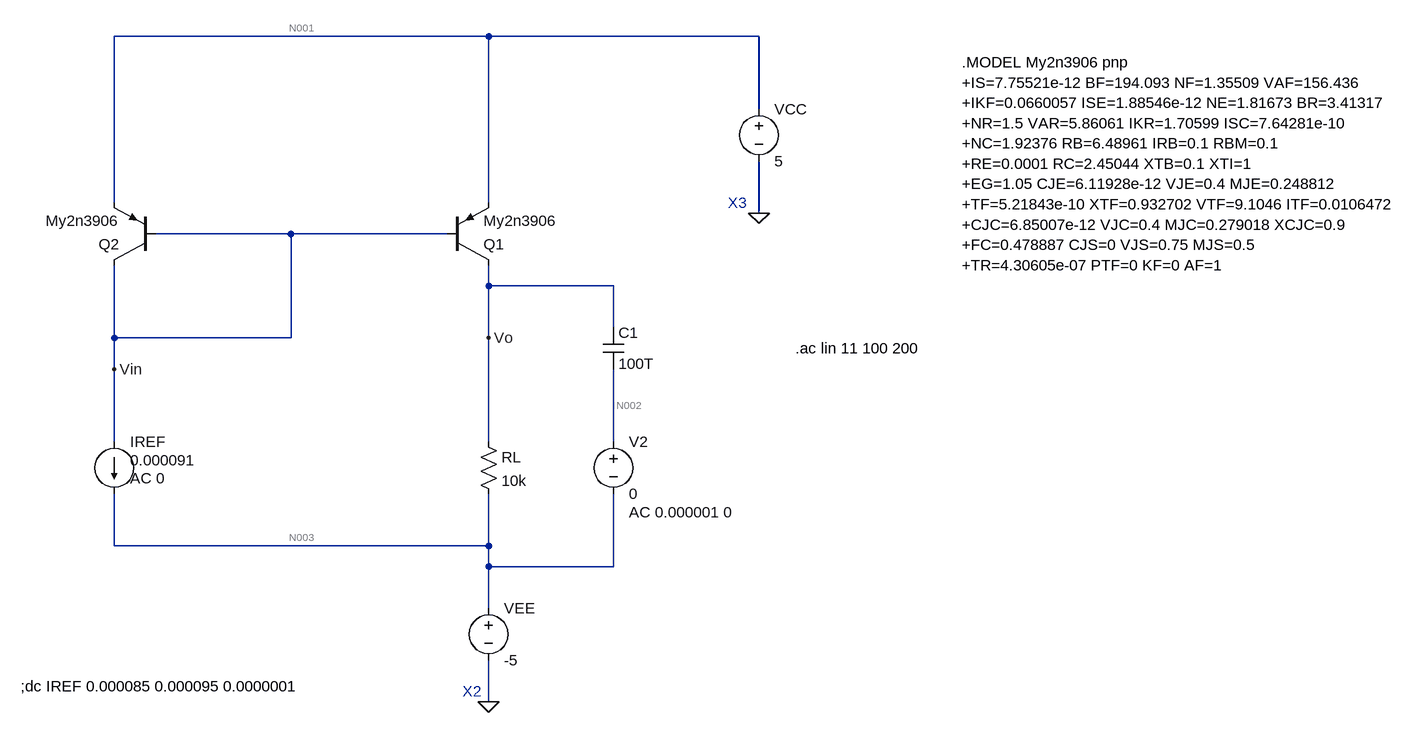
[diagram p0: schematic B.asc]
B.asc, the LTspice schematic file:
Version 4
SHEET 1 1424 680
WIRE -32 -576 -608 -576
WIRE 384 -576 -32 -576
WIRE 384 -464 384 -576
WIRE -608 -320 -608 -576
WIRE -32 -320 -32 -576
WIRE 384 -304 384 -384
WIRE -336 -272 -544 -272
WIRE -96 -272 -336 -272
WIRE -32 -192 -32 -224
WIRE 160 -192 -32 -192
WIRE 160 -128 160 -192
WIRE -608 -112 -608 -224
WIRE -336 -112 -336 -272
WIRE -336 -112 -608 -112
WIRE -32 -112 -32 -192
WIRE -608 -64 -608 -112
WIRE -608 48 -608 -64
WIRE -32 48 -32 -112
WIRE 160 48 160 -64
WIRE -608 208 -608 128
WIRE -32 208 -32 128
WIRE -32 208 -608 208
WIRE -32 240 -32 208
WIRE 160 240 160 128
WIRE 160 240 -32 240
WIRE -32 304 -32 240
WIRE -32 448 -32 384
FLAG -32 448 0
FLAG 384 -304 0
FLAG -32 -112 Vo
FLAG -608 -64 Vin
SYMBOL voltage -32 288 R0
WINDOW 123 0 0 Left 0
WINDOW 39 0 0 Left 0
SYMATTR InstName VEE
SYMATTR Value -5
SYMBOL res -48 32 R0
SYMATTR InstName RL
SYMATTR Value 10k
SYMBOL pnp -96 -224 M180
SYMATTR InstName Q1
SYMATTR Value My2n3906
SYMBOL pnp -544 -224 R180
SYMATTR InstName Q2
SYMATTR Value My2n3906
SYMBOL voltage 384 -480 R0
WINDOW 123 0 0 Left 0
WINDOW 39 0 0 Left 0
SYMATTR InstName VCC
SYMATTR Value 5
SYMBOL current -608 48 R0
WINDOW 3 24 28 Left 2
WINDOW 123 24 56 Left 2
WINDOW 39 0 0 Left 0
SYMATTR InstName IREF
SYMATTR Value 0.000091
SYMATTR Value2 AC 0
SYMBOL cap 144 -128 R0
SYMATTR InstName C1
SYMATTR Value 100T
SYMBOL voltage 160 32 R0
WINDOW 123 24 124 Left 2
WINDOW 39 0 0 Left 0
SYMATTR InstName V2
SYMATTR Value 0
SYMATTR Value2 AC 0.000001 0
TEXT 336 -320 Left 2 ;X3
TEXT 696 -536 Left 2 !.MODEL My2n3906 pnp\n+IS=7.75521e-12 BF=194.093 NF=1.35509 VAF=156.436\n+IKF=0.0660057 ISE=1.88546e-12 NE=1.81673 BR=3.41317\n+NR=1.5 VAR=5.86061 IKR=1.70599 ISC=7.64281e-10\n+NC=1.92376 RB=6.48961 IRB=0.1 RBM=0.1\n+RE=0.0001 RC=2.45044 XTB=0.1 XTI=1\n+EG=1.05 CJE=6.11928e-12 VJE=0.4 MJE=0.248812\n+TF=5.21843e-10 XTF=0.932702 VTF=9.1046 ITF=0.0106472\n+CJC=6.85007e-12 VJC=0.4 MJC=0.279018 XCJC=0.9\n+FC=0.478887 CJS=0 VJS=0.75 MJS=0.5\n+TR=4.30605e-07 PTF=0 KF=0 AF=1
TEXT -72 432 Left 2 ;X2
TEXT -752 424 Left 2 !;dc IREF 0.000085 0.000095 0.0000001
TEXT 440 -96 Left 2 !.ac lin 11 100 200

The netlist it stands for:
* B.asc
VEE N003 0 -5
RL Vo N003 10k
Q1 Vo Vin N001 0 My2n3906
Q2 Vin Vin N001 0 My2n3906
VCC N001 0 5
IREF Vin N003 0.000091 AC 0
C1 Vo N002 100T
V2 N002 N003 0 AC 0.000001 0
.model NPN NPN
.model PNP PNP
.lib standard.bjt
* X3
.MODEL My2n3906 pnp
+IS=7.75521e-12 BF=194.093 NF=1.35509 VAF=156.436
+IKF=0.0660057 ISE=1.88546e-12 NE=1.81673 BR=3.41317
+NR=1.5 VAR=5.86061 IKR=1.70599 ISC=7.64281e-10
+NC=1.92376 RB=6.48961 IRB=0.1 RBM=0.1
+RE=0.0001 RC=2.45044 XTB=0.1 XTI=1
+EG=1.05 CJE=6.11928e-12 VJE=0.4 MJE=0.248812
+TF=5.21843e-10 XTF=0.932702 VTF=9.1046 ITF=0.0106472
+CJC=6.85007e-12 VJC=0.4 MJC=0.279018 XCJC=0.9
+FC=0.478887 CJS=0 VJS=0.75 MJS=0.5
+TR=4.30605e-07 PTF=0 KF=0 AF=1
* X2
;dc IREF 0.000085 0.000095 0.0000001
.ac lin 11 100 200
.backanno
.end

* Results of the author's LTspice run, read from the files saved beside the schematic
* Operating Point, zero values left out:
*   V(n003) = -5 V
*   V(vo) = -5 V
*   V(vin) = 4.426 V
*   V(n001) = 5 V
*   V(n002) = -5 V
*   Ic(Q2) = -89.23 µA
*   Ib(Q2) = -887 nA
*   Ie(Q2) = 90.11 µA
*   Ic(Q1) = -95.19 µA
*   Ib(Q1) = -886.2 nA
*   Ie(Q1) = 96.07 µA
*   I(C1) = 95.19 µA
*   I(Iref) = 91 µA
*   I(Rl) = 95.19 pA
*   I(V2) = 95.19 µA
*   I(Vcc) = -186.2 µA
*   I(Vee) = 186.2 µA
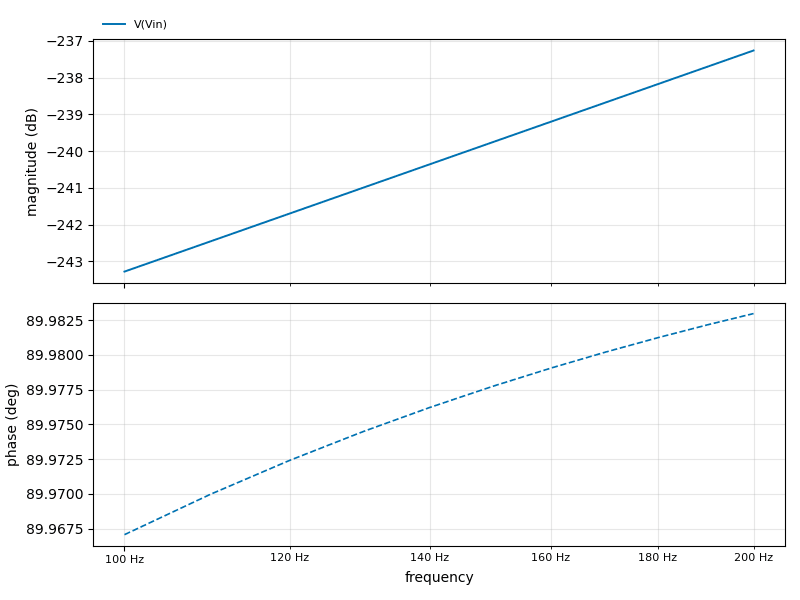
[diagram p1: AC Analysis of B.asc, plotted from the saved traces]
* AC Analysis, 1 run:
*   V(Vin): -243.28 dB at 100 Hz, -237.26 dB at 200 Hz, peak -237.26 dB at 200 Hz, 3 dB below the peak at 141.4 Hz